# EAGLE design CPS2 CN7 Adapter V1_1 (EAGLE 7.7.0)
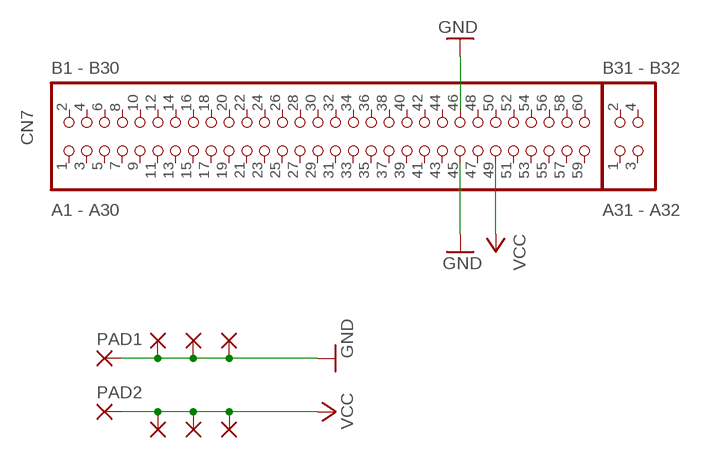
[diagram p0: schematic, sheet 1]

## Parts
JP1  PINHD-2X30  [2X30]
JP2  PINHD-2X2  [2X02]
PAD1  SMD2  [SMD1,27-2,54]
PAD2  SMD2  [SMD1,27-2,54]
PAD3  SMD2  [SMD1,27-2,54]
PAD4  SMD2  [SMD1,27-2,54]
PAD5  SMD2  [SMD1,27-2,54]
PAD6  SMD2  [SMD1,27-2,54]
PAD7  SMD2  [SMD1,27-2,54]
PAD8  SMD2  [SMD1,27-2,54]

## Nets
GND: JP1.45 JP1.46 PAD1.1(P) PAD3.1(P) PAD5.1(P) PAD6.1(P)
VCC: JP1.49 PAD2.1(P) PAD4.1(P) PAD7.1(P) PAD8.1(P)
Unconnected: JP1.1 JP1.2 JP1.3 JP1.4 JP1.5 JP1.6 JP1.7 JP1.8 JP1.9 JP1.10 JP1.11 JP1.12 JP1.13 JP1.14 JP1.15 JP1.16 JP1.17 JP1.18 JP1.19 JP1.20 JP1.21 JP1.22 JP1.23 JP1.24 JP1.25 JP1.26 JP1.27 JP1.28 JP1.29 JP1.30 JP1.31 JP1.32 JP1.33 JP1.34 JP1.35 JP1.36 JP1.37 JP1.38 JP1.39 JP1.40 JP1.41 JP1.42 JP1.43 JP1.44 JP1.47 JP1.48 JP1.50 JP1.51 JP1.52 JP1.53 JP1.54 JP1.55 JP1.56 JP1.57 JP1.58 JP1.59 JP1.60 JP2.1 JP2.2 JP2.3 JP2.4

## Notes on the sheet
- B1 - B30 | B31 - B32
- CN7
- A1 - A30 | A31 - A32

## Library data of the parts
JP1 = pinhead:PINHD-2X30: PIN HEADER
JP2 = pinhead:PINHD-2X2: PIN HEADER
PAD1-PAD8 = wirepad:SMD2: SMD PAD

## Board
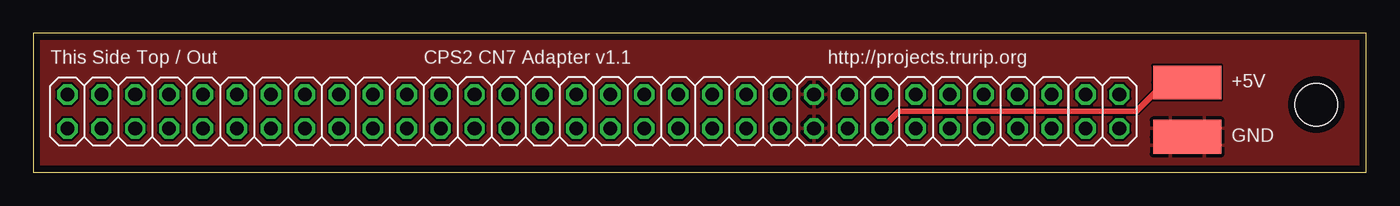
[diagram p1: board, top side]
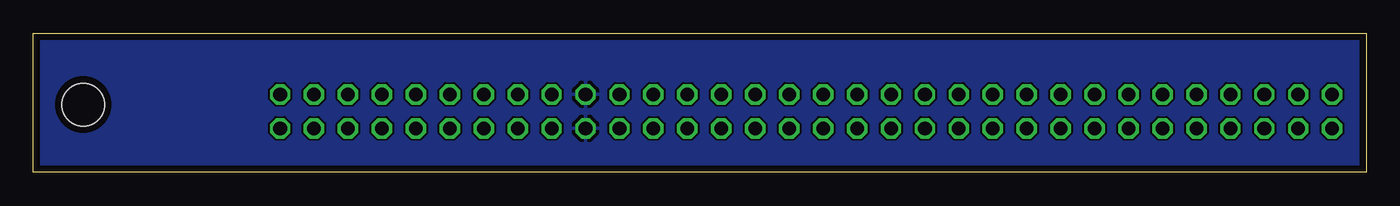
[diagram p2: board, bottom side, seen from below]

Size 99.75 x 10.4 mm. Coordinates in mm from the lower left corner, seen from the top.
Outline: 0,0 99.75,0 99.75,10.4 0,10.4 0,0
Copper layers (1*16): Top 0.035mm / dielectric 1.6mm / Bottom 0.035mm
Design rules "Elecrow_2-layer_PCB_eagle_rule": minimum track width 6mil, minimum drill 12mil, track to track 6mil, track to pad 6mil, pad to pad 6mil, via to via 8mil, smd to smd 0mil, copper to edge 20mil, drill to drill 10mil, minimum pad ring 6mil, minimum via ring 6mil, stop-mask expansion 0mil, vias tented up to drill 100mil, thermal gap 10mil
Holes 3.2 mm at 96.01,5.08

### Footprints (pad centres in the part's own frame; a part is rotated, then mirrored left to right if it is on the bottom)
2X30 = drill 1.016 octagon: 1 -38.1,-1.27; 2 -38.1,1.27; 3 -35.56,-1.27; 4 -35.56,1.27; 5 -33.02,-1.27; 6 -33.02,1.27; 7 -30.48,-1.27; 8 -30.48,1.27; 9 -27.94,-1.27; 10 -27.94,1.27; 11 -25.4,-1.27; 12 -25.4,1.27; 13 -22.86,-1.27; 14 -22.86,1.27; 15 -20.32,-1.27; 16 -20.32,1.27; 17 -17.78,-1.27; 18 -17.78,1.27; 19 -15.24,-1.27; 20 -15.24,1.27; 21 -12.7,-1.27; 22 -12.7,1.27; 23 -10.16,-1.27; 24 -10.16,1.27; 25 -7.62,-1.27; 26 -7.62,1.27; 27 -5.08,-1.27; 28 -5.08,1.27; 29 -2.54,-1.27; 30 -2.54,1.27; 31 0,-1.27; 32 0,1.27; 33 2.54,-1.27; 34 2.54,1.27; 35 5.08,-1.27; 36 5.08,1.27; 37 7.62,-1.27; 38 7.62,1.27; 39 10.16,-1.27; 40 10.16,1.27; 41 12.7,-1.27; 42 12.7,1.27; 43 15.24,-1.27; 44 15.24,1.27; 45 17.78,-1.27; 46 17.78,1.27; 47 20.32,-1.27; 48 20.32,1.27; 49 22.86,-1.27; 50 22.86,1.27; 51 25.4,-1.27; 52 25.4,1.27; 53 27.94,-1.27; 54 27.94,1.27; 55 30.48,-1.27; 56 30.48,1.27; 57 33.02,-1.27; 58 33.02,1.27; 59 35.56,-1.27; 60 35.56,1.27
2X02 = drill 1.016 octagon: 1 -1.27,-1.27; 2 -1.27,1.27; 3 1.27,-1.27; 4 1.27,1.27
SMD1,27-2,54 = smd 1.27 x 2.54: 1 0,0

### Placement (x,y rotation side)
JP1  40.64,4.57 0 top
JP2  80.01,4.57 0 top
PAD1  85.09,3.3 90 top
PAD2  85.09,6.1 90 top
PAD3  85.09,2.03 90 top
PAD4  85.09,7.37 90 top
PAD5  87.63,3.3 90 top
PAD6  87.63,2.03 90 top
PAD7  87.63,6.1 90 top
PAD8  87.63,7.37 90 top

### Tracks (layer width: path | path; a pad name or v marks a point on that pad's centre or on a via)
GND
  pour Top: -1.27,12.19 101.6,12.19 101.6,-0.51 -1.27,-0.51
  pour Bottom: -2.54,10.92 100.33,10.92 100.33,-1.78 -2.54,-1.78
VCC
  Top 0.406: JP1.49 64.77,4.57 82.55,4.57 84.07,6.1 PAD2.1 PAD4.1 PAD8.1 PAD7.1

### Text on the board
tNames: This Side Top / Out | CPS2 CN7 Adapter v1.1 | http://projects.trurip.org | +5V | GND